# Altium schematic sheet Data.SchDoc: Part Data - Schumann experiment
size 420 x 297 mm; Author: Damien POIX; CompanyName: Space'Tech Orléans; SheetNumber: 3; SheetTotal: 3
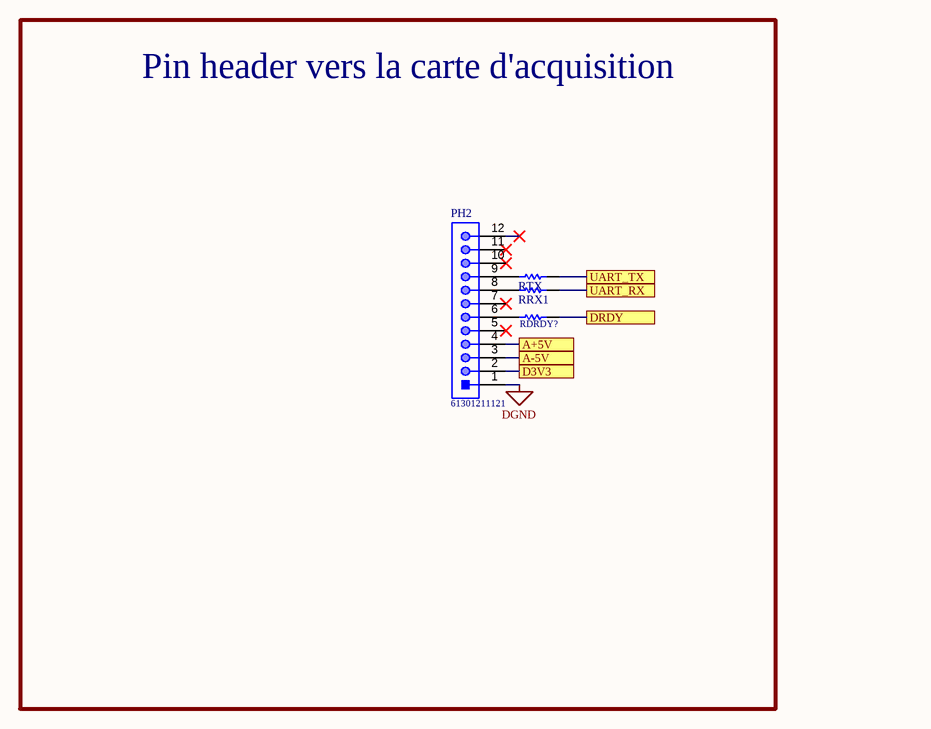
[diagram p0: Data.SchDoc]

## Parts
PH2  61301211121  [61301211121]
RDRDY?  ERA6AEB473V  [RESC2013X60X40ML20T25]  (value not drawn)
RRX1  ERA6AEB473V  [RESC2013X60X40ML20T25]  (value not drawn)
RTX  ERA6AEB473V  [RESC2013X60X40ML20T25]  (value not drawn)

## Blocks framed on the sheet
Pin header vers la carte d'acquisition: PH2 RDRDY? RRX1 RTX

## Ports
A+5V, A-5V, D3V3, DRDY, UART_RX, UART_TX

## Nets
DGND: PH2.1
A+5V: PH2.4 ; port A+5V
A-5V: PH2.3 ; port A-5V
D3V3: PH2.2 ; port D3V3
DRDY: RDRDY?.2 ; port DRDY
UART_RX: RRX1.2 ; port UART_RX
UART_TX: RTX.2 ; port UART_TX
NetPH2_6: PH2.6 RDRDY?.1
NetPH2_8: PH2.8 RRX1.1
NetPH2_9: PH2.9 RTX.1

Not connected (* = marked no-connect by the designer): PH2 5* 7* 10* 11* 12*

## Notes on the sheet
- THIS DOCUMENT AND THE DATA DISCLOSED HEREIN OR
- HEREWITH IS THE PROPERTY OF NANOLAB ACADEMY
- DWG NO:
- REVISION
- REV:
- DESCRIPTION
- DATE
- APPROVED
- AND THE CENTRE NATIONAL D'ETUDES SPATIALES (CNES).
- AUTHORS
- PROJECT
- REFERENCE DOCUMENTS
- PROJECT REVISION:
- TITLE
- DOCUMENT REVISION:
- LAST MODIFIED
- BOM:
- FAB DWG:
- PCB DWG:
- ASSY DWG:
- SCALE:
- SIZE
- A3
- CAGE CODE
- FILE NAME
- DWG NO.
- SHEET
- OF
- REV

## Library data of the parts
PH2 = CMP-1502-01086-1: THT Vertical Pin Header WR-PHD, Pitch 2.54 mm, Single Row, 12 pins; Manufacturer: Wurth Elektronik; Pin Number: 12; Gender: Male; Working Voltage: 250VAC; Rated Current: 3A; Withstanding Voltage: 500VAC; Pitch: 2.54mm; Contact Resistance: 20mOhm; Orientation: Vertical; Package Reference: 61301211121; Packaging: Bag; Operating Temperature: -40to105degC; Mounting Technology: THT; Part Number: 61301211121; Manufacturer URL: http://www.we-online.de; Row Number: Single; Publisher: WurthElektronik; Datasheet URL: https://katalog.we-online.de/em/datasheet/6130xx11121.pdf
RDRDY? RRX1 RTX = CMP-2001-00645-1: Manufacturer: Panasonic; Part Number: ERA6AEB473V